# EAGLE design OLED_Shield (EAGLE 7.4.0)
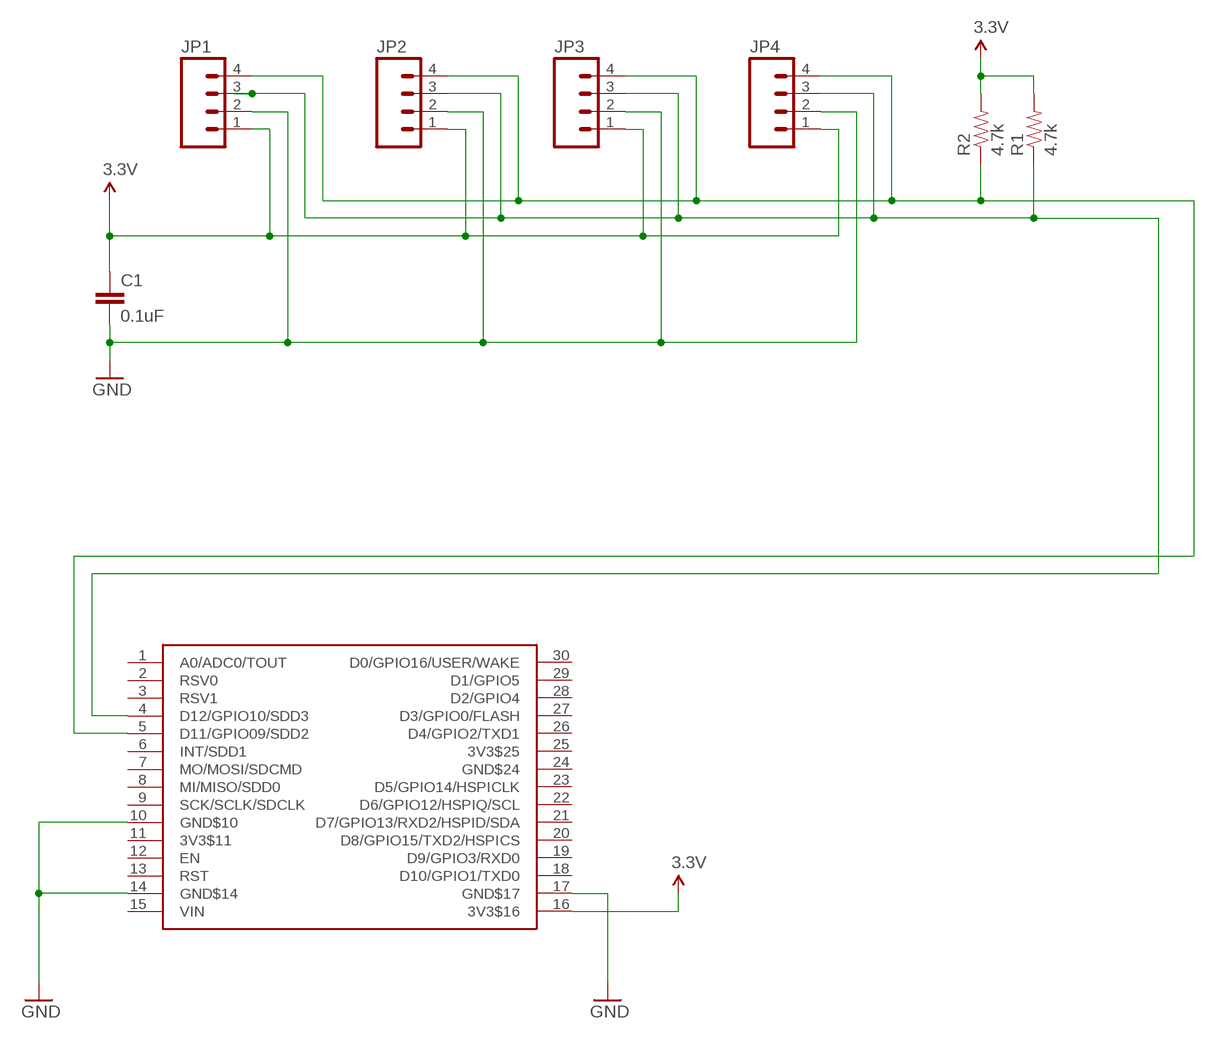
[diagram p0: schematic, sheet 1]

## Parts
C1  0.1uF  CAP0402-CAP  [0402-CAP]
JP1  M041X04_NO_SILK  [1X04_NO_SILK]
JP2  M041X04_NO_SILK  [1X04_NO_SILK]
JP3  M041X04_NO_SILK  [1X04_NO_SILK]
JP4  M041X04_NO_SILK  [1X04_NO_SILK]
R1  4.7k  RESISTOR0402-RES  [0402-RES]
R2  4.7k  RESISTOR0402-RES  [0402-RES]
U$1  NERDSHIELD  [NERDUINO_STACK]

## Nets
3.3V: C1.1 JP1.1 JP2.1 JP3.1 JP4.1 R1.2 R2.2 U$1.16(3V3$16)
GND: C1.2 JP1.2 JP2.2 JP3.2 JP4.2 U$1.10(GND$10) U$1.14(GND$14) U$1.17(GND$17)
N$2: JP1.4 JP2.4 JP3.4 JP4.4 R2.1 U$1.5(D11/GPIO09/SDD2)
N$3: JP1.3 JP2.3 JP3.3 JP4.3 R1.1 U$1.4(D12/GPIO10/SDD3)
Unconnected: U$1.1(A0/ADC0/TOUT) U$1.2(RSV0) U$1.3(RSV1) U$1.6(INT/SDD1) U$1.7(MO/MOSI/SDCMD) U$1.8(MI/MISO/SDD0) U$1.9(SCK/SCLK/SDCLK) U$1.11(3V3$11) U$1.12(EN) U$1.13(RST) U$1.15(VIN) U$1.18(D10/GPIO1/TXD0) U$1.19(D9/GPIO3/RXD0) U$1.20(D8/GPIO15/TXD2/HSPICS) U$1.21(D7/GPIO13/RXD2/HSPID/SDA) U$1.22(D6/GPIO12/HSPIQ/SCL) U$1.23(D5/GPIO14/HSPICLK) U$1.24(GND$24) U$1.25(3V3$25) U$1.26(D4/GPIO2/TXD1) U$1.27(D3/GPIO0/FLASH) U$1.28(D2/GPIO4) U$1.29(D1/GPIO5) U$1.30(D0/GPIO16/USER/WAKE)

## Library data of the parts
C1 = SparkFun:CAP: Capacitor Standard 0603 ceramic capacitor, and 0.1" leaded capacitor.
JP1-JP4 = SparkFun:M04: Header 4 Standard 4-pin 0.1" header. Use with straight break away headers (SKU : PRT-00116), right angle break away headers (PRT-00553), swiss pins (PRT-00743), machine pins (PRT-00117), and female headers (PRT-00115). Molex polarized connector foot print use with SKU : PRT-08231 with associated crimp pins and housings. 1MM SMD Version SKU: PRT-10208
R1 R2 = SparkFun:RESISTOR: Resistor Basic schematic elements and footprints for 0603, 1206, and PTH resistors.
U$1 = NerduinoShieldLib:NERDSHIELD

## Board
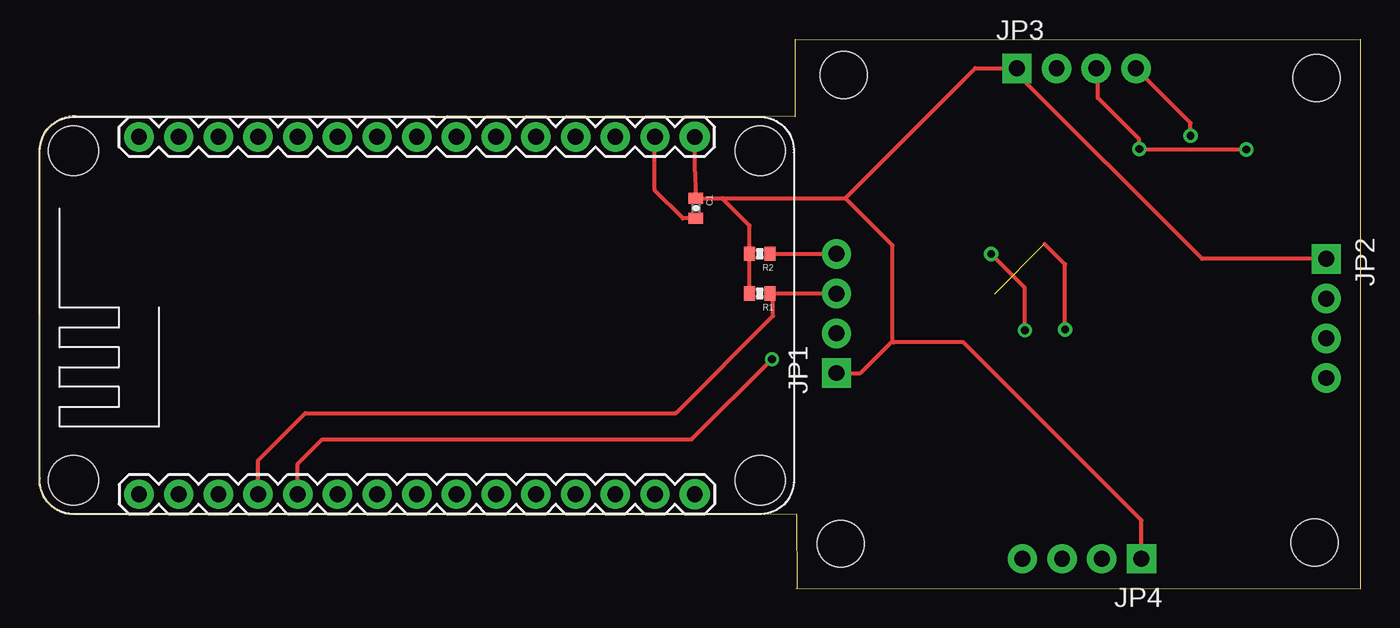
[diagram p1: board, top side]
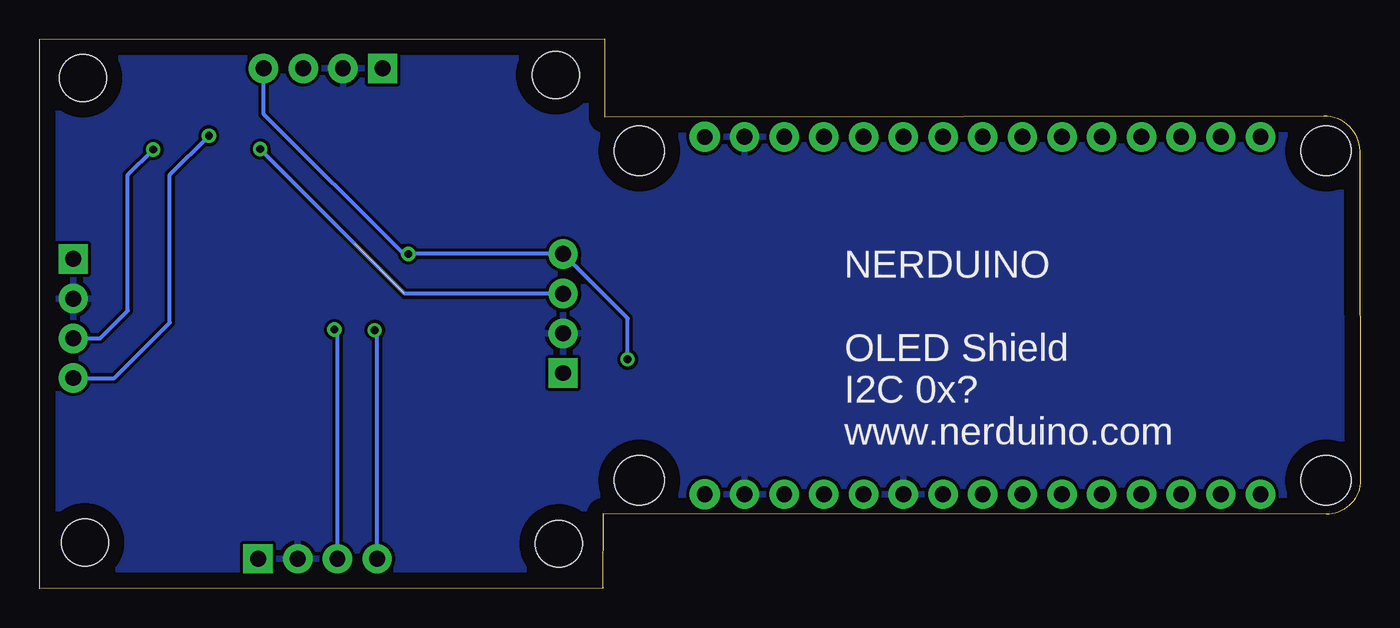
[diagram p2: board, bottom side, seen from below]

Size 84.56 x 35.17 mm. Coordinates in mm from the lower left corner, seen from the top.
Outline: 48.48,4.79 2.2,4.76 arc-90 0,6.97 0.06,28 arc-90 2.33,30.26 48.36,30.21
Outline: 84.54,35.17 84.54,0
Outline: 48.48,4.79 48.49,0.04
Outline: 48.37,35.17 48.36,30.2
Outline: 48.45,0.03 84.56,0
Outline: 48.36,35.16 84.55,35.14
Copper layers (1*16): Top 0.035mm / dielectric 1.5mm / Bottom 0.035mm
Design rules "default": minimum track width 10mil, minimum drill 24mil, track to track 8mil, track to pad 8mil, pad to pad 8mil, via to via 8mil, smd to smd 8mil, copper to edge 40mil, drill to drill 8mil, minimum pad ring 10mil, minimum via ring 8mil, stop-mask expansion 4mil, vias tented up to drill 0mil, thermal gap 10mil
Holes 3 mm at 51.5,32.88 51.3,2.89 81.61,2.96 81.74,32.69

### Footprints (pad centres in the part's own frame; a part is rotated, then mirrored left to right if it is on the bottom)
0402-CAP = smd 0.7 x 0.9: 1 -0.65,0; 2 0.65,0
1X04_NO_SILK = drill 1.016 pad 1.88 square: 1 0,0 | drill 1.016 pad 1.88: 2 2.54,0; 3 5.08,0; 4 7.62,0
0402-RES = smd 0.7 x 0.9: 1 -0.65,0; 2 0.65,0
NERDUINO_STACK = drill 1.016 pad 1.88: 1 -17.78,-5.08; 2 -15.24,-5.08; 3 -12.7,-5.08; 4 -10.16,-5.08; 5 -7.62,-5.08; 6 -5.08,-5.08; 7 -2.54,-5.08; 8 0,-5.08; 9 2.54,-5.08; 10 5.08,-5.08; 11 7.62,-5.08; 12 10.16,-5.08; 13 12.7,-5.08; 14 15.24,-5.08; 17 15.24,17.78; 18 12.7,17.78; 19 10.16,17.78; 20 7.62,17.78; 21 5.08,17.78; 22 2.54,17.78; 23 0,17.78; 24 -2.54,17.78; 25 -5.08,17.78; 26 -7.62,17.78; 27 -10.16,17.78; 28 -12.7,17.78; 29 -15.24,17.78; 30 -17.78,17.78 | drill 1 pad 1.93: 15 17.78,-5.08; 16 17.78,17.78 | hole 3.175: -21.971,16.891; -21.971,-4.191; 21.971,-4.191; 21.971,16.891

### Placement (x,y rotation side)
C1  42.02,24.35 270 top
JP1  51.02,13.81 90 top
JP2  82.37,21.11 270 top
JP3  62.57,33.3 0 top
JP4  70.54,1.93 180 top
R1  46.12,18.9 180 top
R2  46.11,21.44 180 top
U$1  24.17,11.14 0 top

### Tracks (layer width: path | path; a pad name or v marks a point on that pad's centre or on a via)
3.3V
  Top 0.254: U$1.16 41.95,27.03 C1.1 43.7,25 | 43.7,25 51.59,25 | 51.59,25 59.9,33.31 62.23,33.31 | 62.23,33.31 JP3.1 | JP1.1 52.57,13.81 54.62,15.86 | 54.62,15.86 54.62,21.97 51.59,25 | JP2.1 74.43,21.11 62.23,33.31 | JP4.1 70.54,4.39 59.15,15.78 54.7,15.78 54.62,15.86 | R1.2 R2.2 45.46,23.24 43.7,25
GND
  Top 0.254: C1.2 41.2,23.7 39.39,25.51 39.39,28.9 U$1.17
  pour Bottom: 0.08,30.27 48.66,30.13 48.66,35.33 84.53,35.33 84.53,-0.05 48.4,-0.05 48.4,4.82 -0.06,4.82
N$2  (via drill 0.5)
  Top 0.254: v73.68,28.99 73.68,29.81 JP3.4 | v63.07,16.55 63.07,19.28 v60.92,21.43 | R2.1 JP1.4 | U$1.5 16.55,8 18.11,9.56 41.76,9.56 v46.89,14.69
  Bottom 0.254: JP3.4 70.17,33.28 70.17,30.37 61.23,21.43 v60.92,21.43 JP1.4 46.89,17.3 v46.89,14.69 | JP2.4 79.73,13.49 76.19,17.03 76.19,26.48 v73.68,28.99 | JP4.4 62.92,16.4 v63.07,16.55
N$3  (via drill 0.5)  (1 unrouted)
  Top 0.254: JP3.3 67.74,33.21 67.74,31.41 70.4,28.75 v70.4,28.14 70.43,28.11 v77.24,28.11 | v65.65,16.6 65.65,20.77 64.34,22.08 | JP1.3 R1.1 46.96,18.71 46.96,17.47 40.74,11.25 17.03,11.25 14.01,8.23 U$1.4
  Bottom 0.254: JP1.3 61.15,18.89 v70.4,28.14 | JP2.3 80.64,16.03 78.87,17.8 78.87,26.48 v77.24,28.11 | JP4.3 65.46,16.41 v65.65,16.6

### Text on the board
_bsilk: NERDUINO / / OLED Shield / I2C 0x? / www.nerduino.com